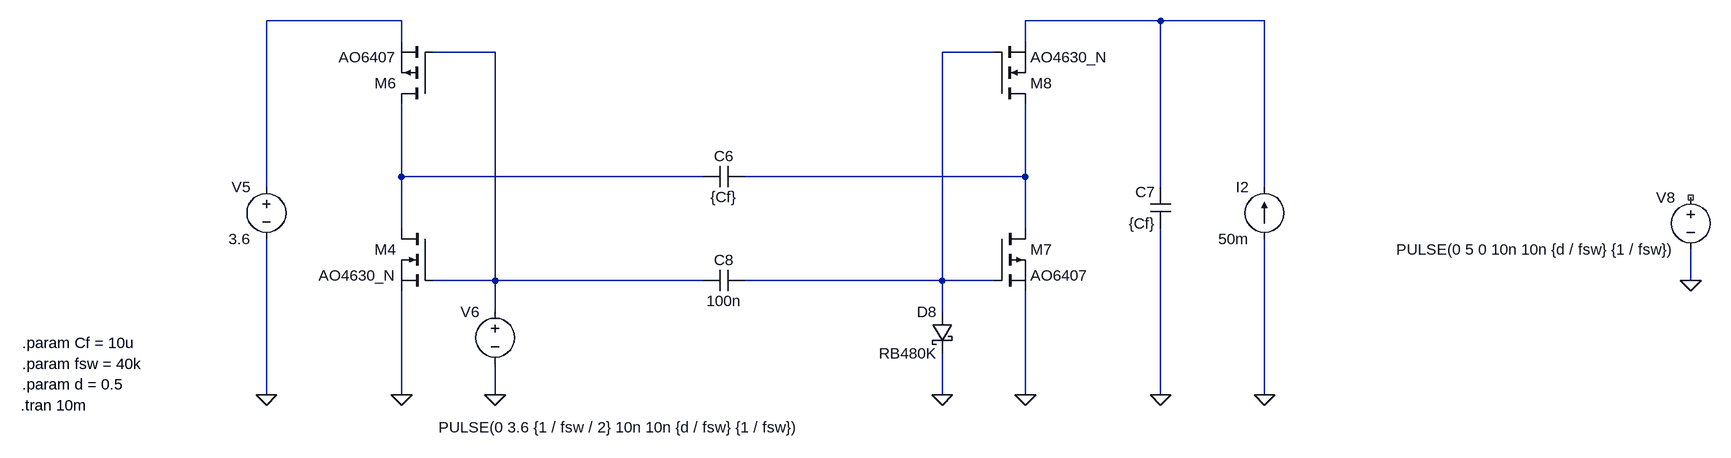
[diagram p0: schematic H-bridge_charge_pump.asc]
H-bridge_charge_pump.asc, the LTspice schematic file:
Version 4
SHEET 1 11460 3748
WIRE -416 352 -624 352
WIRE 752 352 544 352
WIRE 912 352 752 352
WIRE -416 384 -416 352
WIRE 544 384 544 352
WIRE -272 400 -368 400
WIRE 496 400 416 400
WIRE -416 592 -416 480
WIRE 48 592 -416 592
WIRE 544 592 544 480
WIRE 544 592 112 592
WIRE -624 608 -624 352
WIRE 752 608 752 352
WIRE 912 608 912 352
WIRE -416 672 -416 592
WIRE 544 672 544 592
WIRE -272 752 -272 400
WIRE -272 752 -368 752
WIRE 48 752 -272 752
WIRE 416 752 416 400
WIRE 416 752 112 752
WIRE 496 752 416 752
WIRE 1568 752 1568 704
WIRE -272 800 -272 752
WIRE 416 800 416 752
WIRE -624 928 -624 688
WIRE -416 928 -416 768
WIRE -272 928 -272 880
WIRE 416 928 416 864
WIRE 544 928 544 768
WIRE 752 928 752 672
WIRE 912 928 912 688
FLAG -272 928 0
FLAG 752 928 0
FLAG 912 928 0
FLAG -416 928 0
FLAG 1568 752 0
FLAG 544 928 0
FLAG 416 928 0
FLAG -624 928 0
SYMBOL voltage -272 784 M0
WINDOW 123 0 0 Left 0
WINDOW 39 0 0 Left 0
WINDOW 3 -469 194 Left 2
SYMATTR InstName V6
SYMATTR Value PULSE(0 3.6 {1 / fsw / 2} 10n 10n {d / fsw} {1 / fsw})
SYMBOL cap 112 576 R90
WINDOW 0 0 32 VBottom 2
WINDOW 3 32 32 VTop 2
SYMATTR InstName C6
SYMATTR Value {Cf}
SYMBOL cap 768 672 R180
WINDOW 0 24 56 Left 2
WINDOW 3 24 8 Left 2
SYMATTR InstName C7
SYMATTR Value {Cf}
SYMBOL current 912 688 R180
WINDOW 0 24 80 Left 2
WINDOW 3 24 0 Left 2
WINDOW 123 0 0 Left 0
WINDOW 39 0 0 Left 0
SYMATTR InstName I2
SYMATTR Value 50m
SYMBOL nmos -368 672 M0
SYMATTR InstName M4
SYMATTR Value AO4630_N
SYMBOL pmos -368 480 R180
SYMATTR InstName M6
SYMATTR Value AO6407
SYMBOL voltage 1568 608 M0
WINDOW 123 0 0 Left 0
WINDOW 39 0 0 Left 0
SYMATTR InstName V8
SYMATTR Value PULSE(0 5 0 10n 10n {d / fsw} {1 / fsw})
SYMBOL pmos 496 672 R0
SYMATTR InstName M7
SYMATTR Value AO6407
SYMBOL cap 48 736 M90
WINDOW 0 0 32 VBottom 2
WINDOW 3 32 32 VTop 2
SYMATTR InstName C8
SYMATTR Value 100n
SYMBOL schottky 432 800 M0
SYMATTR InstName D8
SYMATTR Value RB480K
SYMATTR Description Diode
SYMATTR Type diode
SYMBOL nmos 496 480 M180
SYMATTR InstName M8
SYMATTR Value AO4630_N
SYMBOL voltage -624 592 M0
WINDOW 123 0 0 Left 0
WINDOW 39 0 0 Left 0
SYMATTR InstName V5
SYMATTR Value 3.6
TEXT -1000 880 Left 2 !.param fsw = 40k
TEXT -1000 912 Left 2 !.param d = 0.5
TEXT -1000 848 Left 2 !.param Cf = 10u
TEXT -1002 944 Left 2 !.tran 10m

The netlist it stands for:
* H-bridge_charge_pump.asc
V6 N003 0 PULSE(0 3.6 {1 / fsw / 2} 10n 10n {d / fsw} {1 / fsw})
C6 N006 N005 {Cf}
C7 0 N002 {Cf}
I2 0 N002 50m
M4 N005 N003 0 0 AO4630_N
M6 N005 N003 N001 N001 AO6407
V8 NC_01 0 PULSE(0 5 0 10n 10n {d / fsw} {1 / fsw})
M7 N006 N004 0 0 AO6407
C8 N003 N004 100n
D8 N004 0 RB480K
M8 N006 N004 N002 N002 AO4630_N
V5 N001 0 3.6
.model D D
.lib standard.dio
.model NMOS NMOS
.model PMOS PMOS
.lib standard.mos
.param fsw = 40k
.param d = 0.5
.param Cf = 10u
.tran 10m
.backanno
.end